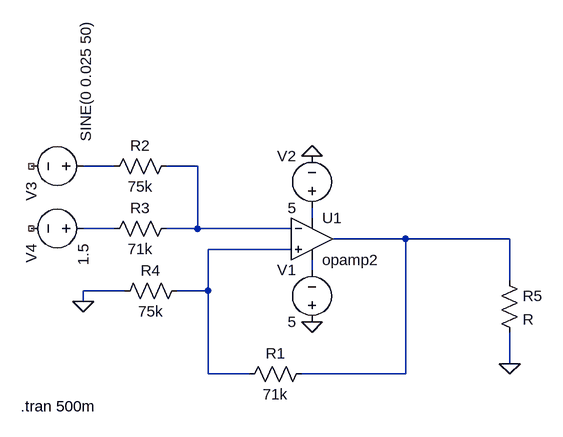
[diagram p0: schematic Draft1.asc]
Draft1.asc, the LTspice schematic file:
Version 4
SHEET 1 880 680
WIRE -112 48 -160 48
WIRE 16 48 -32 48
WIRE 192 128 192 112
WIRE -112 144 -160 144
WIRE 16 144 16 48
WIRE 16 144 -32 144
WIRE 160 144 16 144
WIRE 336 160 224 160
WIRE 496 160 336 160
WIRE 160 176 32 176
WIRE 192 208 192 192
WIRE 496 224 496 160
WIRE -96 240 -160 240
WIRE 32 240 32 176
WIRE 32 240 -16 240
WIRE -160 256 -160 240
WIRE 496 352 496 304
WIRE 32 368 32 240
WIRE 96 368 32 368
WIRE 336 368 336 160
WIRE 336 368 176 368
FLAG 192 288 0
FLAG 192 32 0
FLAG -160 256 0
FLAG 496 352 0
SYMBOL Opamps\\opamp2 192 96 R0
SYMATTR InstName U1
SYMBOL voltage 192 304 R180
WINDOW 0 24 96 Left 2
WINDOW 3 24 16 Left 2
WINDOW 123 0 0 Left 0
WINDOW 39 0 0 Left 0
SYMATTR InstName V1
SYMATTR Value 5
SYMBOL voltage 192 128 R180
WINDOW 0 24 96 Left 2
WINDOW 3 24 16 Left 2
WINDOW 123 0 0 Left 0
WINDOW 39 0 0 Left 0
SYMATTR InstName V2
SYMATTR Value 5
SYMBOL res 192 352 R90
WINDOW 0 0 56 VBottom 2
WINDOW 3 32 56 VTop 2
SYMATTR InstName R1
SYMATTR Value 71k
SYMBOL res -16 32 R90
WINDOW 0 0 56 VBottom 2
WINDOW 3 32 56 VTop 2
SYMATTR InstName R2
SYMATTR Value 75k
SYMBOL res -16 128 R90
WINDOW 0 0 56 VBottom 2
WINDOW 3 32 56 VTop 2
SYMATTR InstName R3
SYMATTR Value 71k
SYMBOL res 0 224 R90
WINDOW 0 0 56 VBottom 2
WINDOW 3 32 56 VTop 2
SYMATTR InstName R4
SYMATTR Value 75k
SYMBOL voltage -144 48 R90
WINDOW 0 24 96 Left 2
WINDOW 3 -224 12 Left 2
WINDOW 123 0 0 Left 0
WINDOW 39 0 0 Left 0
SYMATTR InstName V3
SYMATTR Value SINE(0 0.025 50)
SYMBOL voltage -144 144 R90
WINDOW 0 24 96 Left 2
WINDOW 3 24 16 Left 2
WINDOW 123 0 0 Left 0
WINDOW 39 0 0 Left 0
SYMATTR InstName V4
SYMATTR Value 1.5
SYMBOL res 480 208 R0
SYMATTR InstName R5
TEXT -256 418 Left 2 !.tran 500m

The netlist it stands for:
* Draft1.asc
XU1 N006 N002 N003 N007 N005 opamp2  ; pins In+ In- V+ V- OUT
V1 0 N007 5
V2 N003 0 5
R1 N005 N006 71k
R2 N002 N001 75k
R3 N002 N004 71k
R4 N006 0 75k
V3 N001 NC_01 SINE(0 0.025 50)
V4 N004 NC_02 1.5
R5 N005 0 R
.tran 500m
.backanno
.end